# EAGLE design NRF24-zero-SHIM (EAGLE 9.6.2)
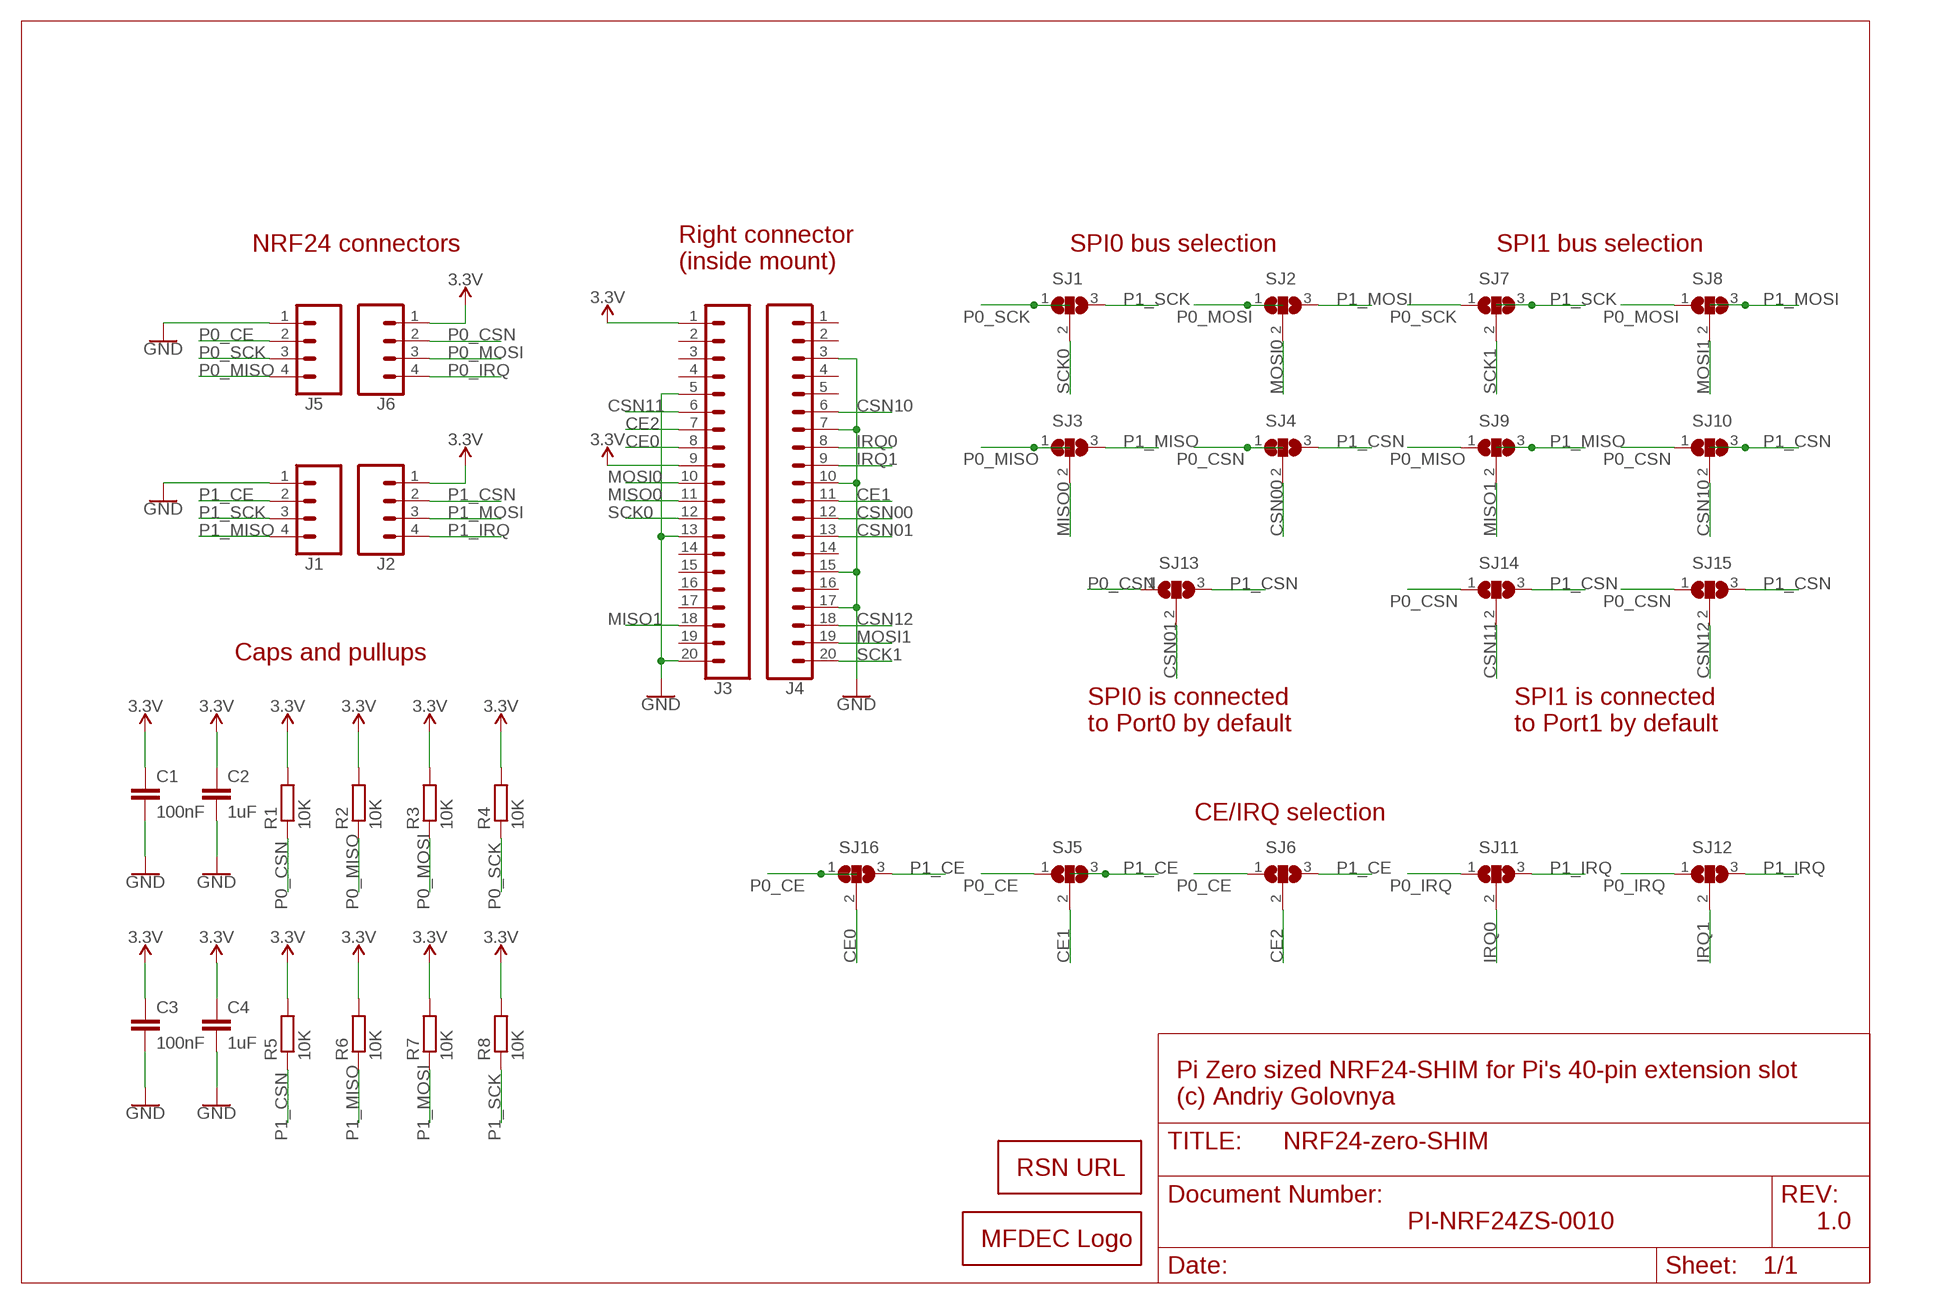
[diagram p0: schematic, sheet 1]

## Parts
C1  100nF  C-EUC0402  [C0402]
C2  1uF  C-EUC0603  [C0603]
C3  100nF  C-EUC0402  [C0402]
C4  1uF  C-EUC0603  [C0603]
J1  CONN_04LOCK  [1X04_LOCK]
J2  CONN_04LOCK  [1X04_LOCK]
J3  CONN_20LOCK  [1X20_LOCK]
J4  CONN_20LOCK  [1X20_LOCK]
J5  CONN_04LOCK  [1X04_LOCK]
J6  CONN_04LOCK  [1X04_LOCK]
LOGO1  MFDECLOGO_SQ_8MM  [MFDEC_SQ_8MM]
LOGO3  RSNURL_QR_10MM  [RSNURL_QR_10MM]
R1  10K  R-EU_R0402  [R0402]
R2  10K  R-EU_R0402  [R0402]
R3  10K  R-EU_R0402  [R0402]
R4  10K  R-EU_R0402  [R0402]
R5  10K  R-EU_R0402  [R0402]
R6  10K  R-EU_R0402  [R0402]
R7  10K  R-EU_R0402  [R0402]
R8  10K  R-EU_R0402  [R0402]
SJ1  SJ2  [SJ_2]
SJ2  SJ2  [SJ_2]
SJ3  SJ2  [SJ_2]
SJ4  SJ2  [SJ_2]
SJ5  SJ2  [SJ_2]
SJ6  SJ2  [SJ_2]
SJ7  SJ2  [SJ_2]
SJ8  SJ2  [SJ_2]
SJ9  SJ2  [SJ_2]
SJ10  SJ2  [SJ_2]
SJ11  SJ2  [SJ_2]
SJ12  SJ2  [SJ_2]
SJ13  SJ2  [SJ_2]
SJ14  SJ2  [SJ_2]
SJ15  SJ2  [SJ_2]
SJ16  SJ2  [SJ_2]

## Nets
3.3V: C1.1 C2.1 C3.1 C4.1 J2.1 J3.1 J3.9 J6.1 R1.2 R2.2 R3.2 R4.2 R5.2 R6.2 R7.2 R8.2
CE0: J3.8 SJ16.2
CE1: J4.11 SJ5.2
CE2: J3.7 SJ6.2
CSN00: J4.12 SJ4.2
CSN01: J4.13 SJ13.2
CSN10: J4.6 SJ10.2
CSN11: J3.6 SJ14.2
CSN12: J4.18 SJ15.2
GND: C1.2 C2.2 C3.2 C4.2 J1.1 J3.5 J3.13 J3.20 J4.3 J4.7 J4.10 J4.15 J4.17 J5.1
IRQ0: J4.8 SJ11.2
IRQ1: J4.9 SJ12.2
MISO0: J3.11 SJ3.2
MISO1: J3.18 SJ9.2
MOSI0: J3.10 SJ2.2
MOSI1: J4.19 SJ8.2
P0_CE: J5.2 SJ5.1 SJ6.1 SJ16.1
P0_CSN: J6.2 R1.1 SJ4.1 SJ10.1 SJ13.1 SJ14.1 SJ15.1
P0_IRQ: J6.4 SJ11.1 SJ12.1
P0_MISO: J5.4 R2.1 SJ3.1 SJ9.1
P0_MOSI: J6.3 R3.1 SJ2.1 SJ8.1
P0_SCK: J5.3 R4.1 SJ1.1 SJ7.1
P1_CE: J1.2 SJ5.3 SJ6.3 SJ16.3
P1_CSN: J2.2 R5.1 SJ4.3 SJ10.3 SJ13.3 SJ14.3 SJ15.3
P1_IRQ: J2.4 SJ11.3 SJ12.3
P1_MISO: J1.4 R6.1 SJ3.3 SJ9.3
P1_MOSI: J2.3 R7.1 SJ2.3 SJ8.3
P1_SCK: J1.3 R8.1 SJ1.3 SJ7.3
SCK0: J3.12 SJ1.2
SCK1: J4.20 SJ7.2
Unconnected: J3.2 J3.3 J3.4 J3.14 J3.15 J3.16 J3.17 J3.19 J4.1 J4.2 J4.4 J4.5 J4.14 J4.16

## Notes on the sheet
- NRF24 connectors | SPI0 bus selection | SPI1 bus selection
- Right connector
  (inside mount)
- Caps and pullups
- SPI0 is connected
  to Port0 by default
- SPI1 is connected
  to Port1 by default
- CE/IRQ selection
- Pi Zero sized NRF24-SHIM for Pi's 40-pin extension slot
  (c) Andriy Golovnya
- PI-NRF24ZS-0010 | 1.0

## Library data of the parts
C1-C4 = rcl:C-EU: CAPACITOR, European symbol; SPICEPREFIX: C
J1 J2 J5 J6 = _my_locked_connectors:CONN_04: Multi connection point. Often used as Generic Header-pin footprint for 0.1 inch spaced/style header connections On any of the 0.1 inch spaced packages, you can populate with these: Break Away Headers - Straight <https://www.sparkfun.com/products/116> (PRT-00116) Break Away Male Headers - Right Angle <https://www.sparkfun.com/products/553> (PRT-00553) Female Headers <https://www.sparkfun.com/products/115> (PRT-00115) Break Away Headers - Machine Pin <https://www.sparkfun.com/products/117> (PRT-00117) Break Away Female Headers - Swiss Machine Pin <https://www.sparkfun.com/products/743> (PRT-00743) For SCREWTERMINALS and SPRING TERMINALS visit here: Screw Terimnals on SparkFun.com <https://www.sparkfun.com/search/results?term=Screw+Terminals> (5mm/3.5mm/2.54mm spacing) This device is also useful as a general connection point to wire up your design to another part of your project. Our various solder wires solder well into these plated through hole pads. Hook-Up Wire - Assortment (Stranded, 22 AWG) <https://www.sparkfun.com/products/11375> (PRT-11375) Hook-Up Wire - Assortment (Solid Core, 22 AWG) <https://www.sparkfun.com/products/11367> (PRT-11367) View the entire wire category on our website here <https://www.sparkfun.com/categories/141> Special notes: Molex polarized connector foot print use with SKU : PRT-08231 with associated crimp pins and housings. 1MM SMD Version SKU: PRT-10208; PROD_ID: CONN-09696
J3 J4 = _my_locked_connectors:CONN_20: Multi connection point. Often used as Generic Header-pin footprint for 0.1 inch spaced/style header connections On any of the 0.1 inch spaced packages, you can populate with these: Break Away Headers - Straight <https://www.sparkfun.com/products/116> (PRT-00116) Break Away Male Headers - Right Angle <https://www.sparkfun.com/products/553> (PRT-00553) Female Headers <https://www.sparkfun.com/products/115> (PRT-00115) Break Away Headers - Machine Pin <https://www.sparkfun.com/products/117> (PRT-00117) Break Away Female Headers - Swiss Machine Pin <https://www.sparkfun.com/products/743> (PRT-00743) For SCREWTERMINALS and SPRING TERMINALS visit here: Screw Terimnals on SparkFun.com <https://www.sparkfun.com/search/results?term=Screw+Terminals> (5mm/3.5mm/2.54mm spacing) This device is also useful as a general connection point to wire up your design to another part of your project. Our various solder wires solder well into these plated through hole pads. Hook-Up Wire - Assortment (Stranded, 22 AWG) <https://www.sparkfun.com/products/11375> (PRT-11375) Hook-Up Wire - Assortment (Solid Core, 22 AWG) <https://www.sparkfun.com/products/11367> (PRT-11367) View the entire wire category on our website here <https://www.sparkfun.com/categories/141> Special notes: Molex polarized connector foot print use with SKU : PRT-08231 with associated crimp pins and housings. 1MM SMD Version SKU: PRT-10208 NOTES ON THE VARIANTS LOCK and LOCK_LONGPADS... This footprint was designed to help hold the alignment of a through-hole component (i.e. 6-pin header) while soldering it into place. You may notice that each hole has been shifted either up or down by 0.005 of an inch from it's more standard position (which is a perfectly straight line). This slight alteration caused the pins (the squares in the middle) to touch the edges of the holes. Because they are alternating, it causes a "brace" to hold the component in place. 0.005 has proven to be the perfect amount of "off-center" position when using our standard breakaway headers. Although looks a little odd when you look at the bare footprint, once you have a header in there, the alteration is very hard to notice. Also,if you push a header all the way into place, it is covered up entirely on the bottom side. Note about LOCK SPECIAL package: This is just like the LOCK variant in that the holes are staggared by 5 mil, but except for the last two holes. They are not altered from the "standard" footprint layout. This is used for a special purpose on the layout of our Graphic LCD Backpack. Make sure you want to use this device before selecting it for you project!
LOGO1 = _my_logos:MFDECLOGO: Midnight Fog - Digital Eye Candy LOGO
LOGO3 = _my_logos:RSNURL: RedScorp.Net URL
R1-R8 = rcl:R-EU_: RESISTOR, European symbol; SPICEPREFIX: R
SJ1-SJ16 = _my_jumpers:SJ2: SMD solder JUMPER SJ2 - simple jumper SJ2FI - fancy inside jumper SJ2FO - fancy outside jumper SJ2FL - fancy left jumper SJ2FR - fancy right jumper SJ2W - wide jumper

## Board
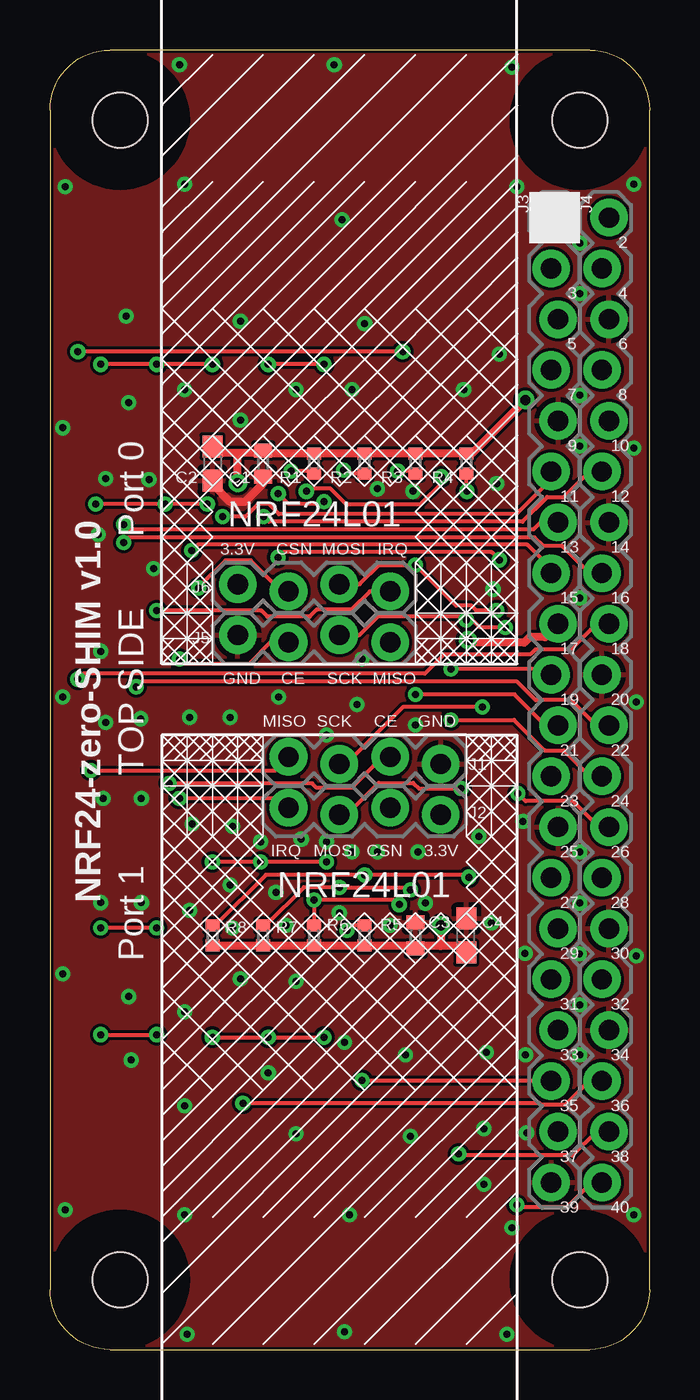
[diagram p1: board, top side]
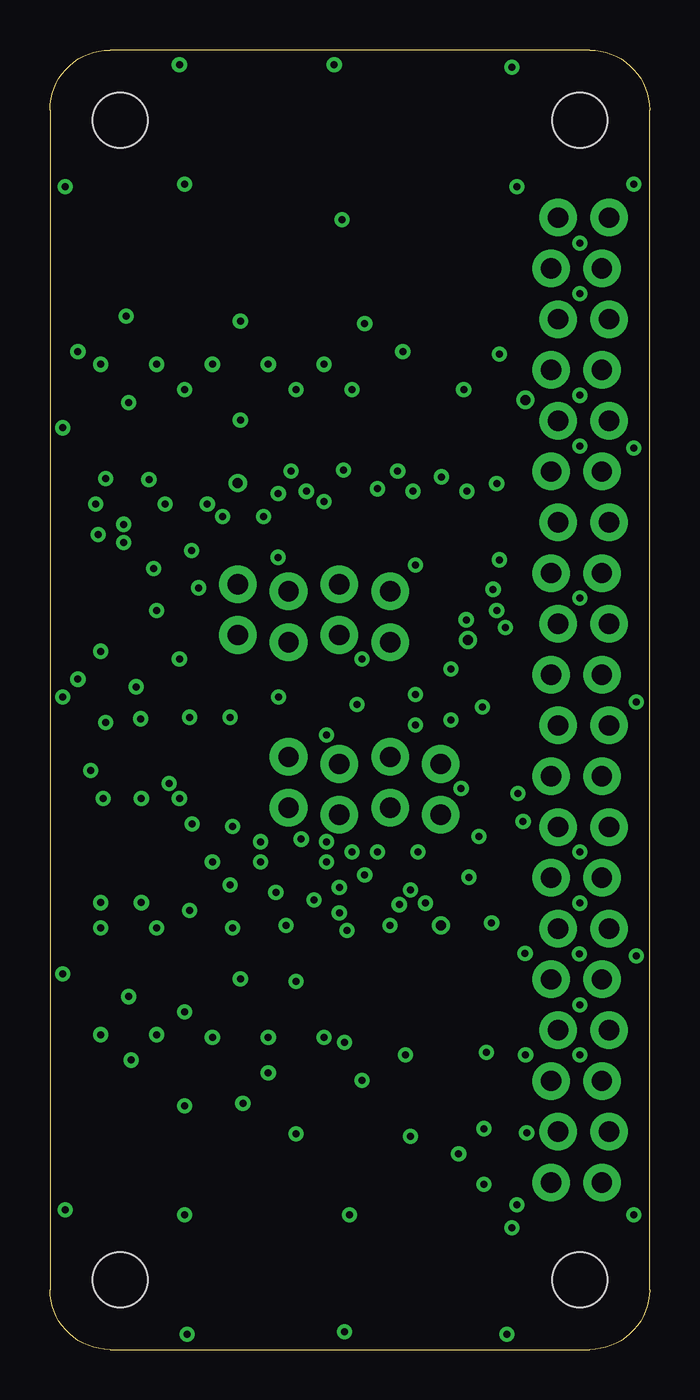
[diagram p2: board, inner layer Route2]
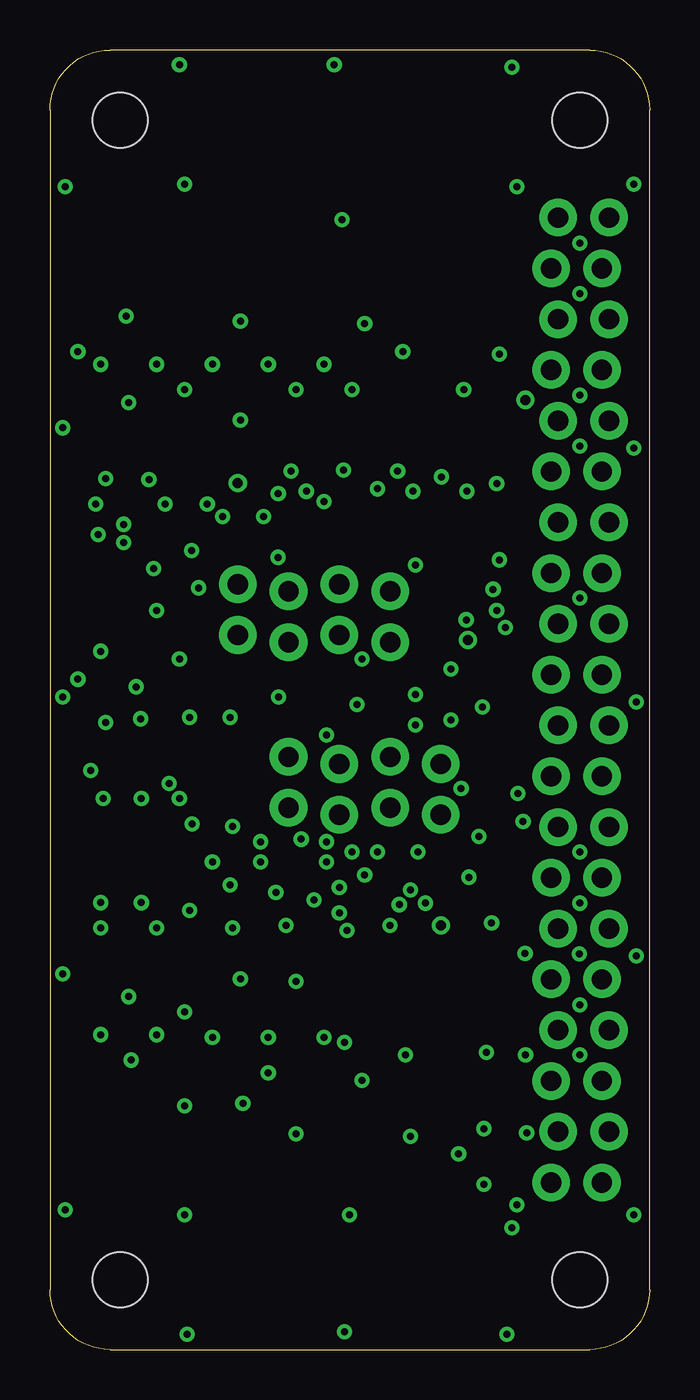
[diagram p3: board, inner layer Route15]
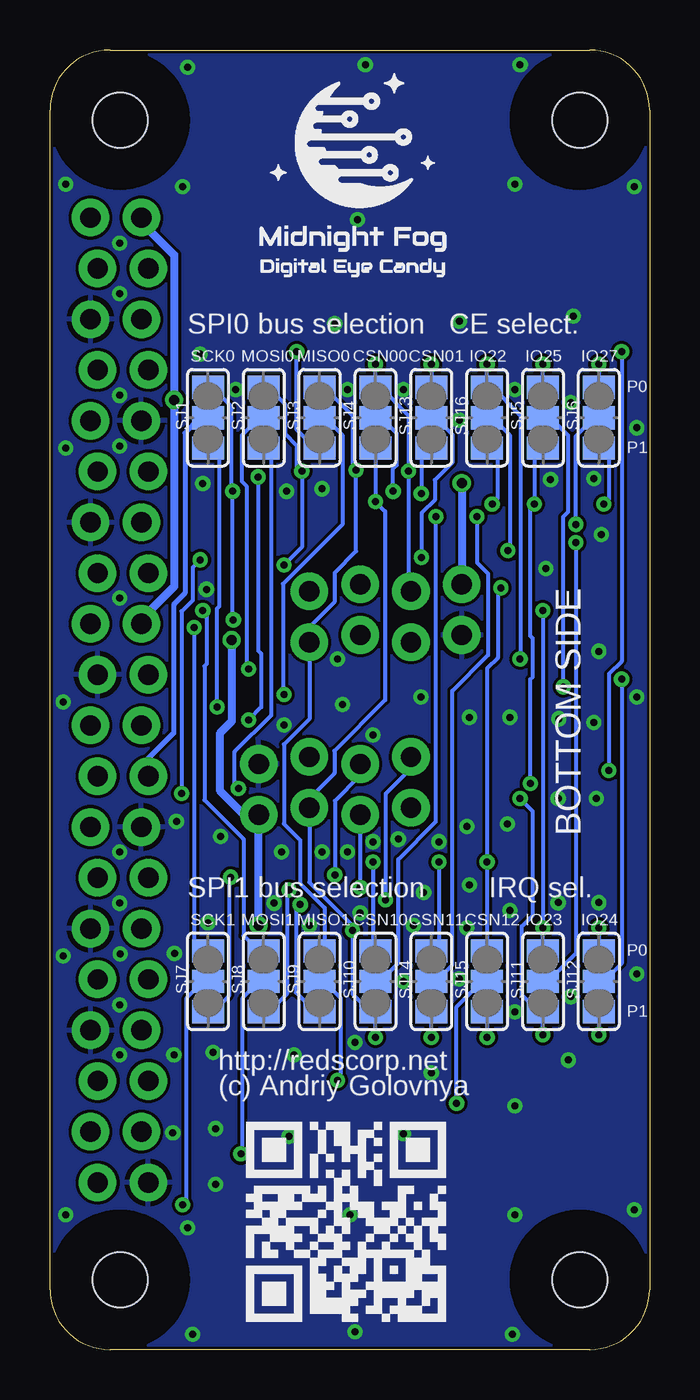
[diagram p4: board, bottom side, seen from below]

Size 30 x 65 mm. Coordinates in mm from the lower left corner, seen from the top.
Outline: 3,0 27,0 arc90 30,3 30,62 arc90 27,65 3,65 arc90 0,62 0,3 arc90 3,0
Copper layers (1*16): Top 0.035mm / dielectric 1.5mm / Bottom 0.035mm
Design rules "default *": minimum track width 6mil, minimum drill 0.35mm, track to track 6mil, track to pad 6mil, pad to pad 6mil, via to via 6mil, smd to smd 6mil, copper to edge 6mil, drill to drill 6mil, minimum pad ring 10mil, minimum via ring 8mil, stop-mask expansion 4mil, vias tented up to drill 20mil, thermal gap 10mil
Holes 2.75 mm at 3.5,3.5 26.5,3.5 3.5,61.5 26.5,61.5

### Footprints (pad centres in the part's own frame; a part is rotated, then mirrored left to right if it is on the bottom)
C0402 = smd 0.7 x 0.9: 1 -0.65,0; 2 0.65,0
C0603 = smd 1.1 x 1: 1 -0.85,0; 2 0.85,0
1X04_LOCK = drill 1.016 pad 1.88: 1 0,0.178; 2 2.54,-0.178; 3 5.08,0.178; 4 7.62,-0.178
1X20_LOCK = drill 1.016 pad 1.88: 1 0,0.178; 2 2.54,-0.178; 3 5.08,0.178; 4 7.62,-0.178; 5 10.16,0.178; 6 12.7,-0.178; 7 15.24,0.178; 8 17.78,-0.178; 9 20.32,0.178; 10 22.86,-0.178; 11 25.4,0.178; 12 27.94,-0.178; 13 30.48,0.178; 14 33.02,-0.178; 15 35.56,0.178; 16 38.1,-0.178; 17 40.64,0.178; 18 43.18,-0.178; 19 45.72,0.178; 20 48.26,-0.178
R0402 = smd 0.6 x 0.7: 1 -0.5,0; 2 0.5,0
SJ_2 = smd 1.168 x 1.6: 1 -1.524,0; 2 0,0; 3 1.524,0

### Placement (x,y rotation side)
C1  10.67,44.32 270 top
C2  8.13,44.32 270 top
C3  18.29,20.7 90 top
C4  20.83,20.7 90 top
J1  19.56,29.46 180 top
J2  19.56,26.92 180 top
J3  25.25,56.62 270 top
J4  27.79,56.62 270 top
J5  9.4,35.56 0 top
J6  9.4,38.1 0 top
LOGO1  20.19,53.34 0 bottom
LOGO3  20.19,1.4 0 bottom
R1  13.21,44.32 90 top
R2  15.75,44.32 90 top
R3  18.29,44.32 90 top
R4  20.83,44.32 90 top
R5  15.75,20.7 270 top
R6  13.21,20.7 270 top
R7  10.67,20.7 270 top
R8  8.13,20.7 270 top
SJ1  22.1,46.61 270 bottom
SJ2  19.3,46.61 270 bottom
SJ3  16.51,46.61 270 bottom
SJ4  13.72,46.61 270 bottom
SJ5  5.33,46.61 270 bottom
SJ6  2.54,46.61 270 bottom
SJ7  22.1,18.41 270 bottom
SJ8  19.3,18.41 270 bottom
SJ9  16.51,18.41 270 bottom
SJ10  13.72,18.41 270 bottom
SJ11  5.33,18.41 270 bottom
SJ12  2.54,18.41 270 bottom
SJ13  10.92,46.61 270 bottom
SJ14  10.92,18.41 270 bottom
SJ15  8.13,18.41 270 bottom
SJ16  8.13,46.61 270 bottom

### Tracks (layer width: path | path; a pad name or v marks a point on that pad's centre or on a via)
3.3V  (via drill 0.5)
  Top 0.406: R8.2 R7.2 R6.2 R5.2 18.14,20.2 C3.1 18.41,20.18 19.56,20.18 | 19.56,20.18 20.5,20.18 C4.1 | 9.4,44.85 10.54,44.85 C1.1 10.82,44.82 R1.2 R2.2 R3.2 R4.2 21.11,44.82 v23.78,47.5 | 9.4,44.85 8.46,44.85 C2.1 | v19.56,21.21 19.56,20.18 | v9.4,43.33 9.4,44.85 | J3.9 24.77,35.63 24.01,35.63 23.73,35.35 21.03,35.35 v20.9,35.48
  Bottom 0.406: J3.1 25.4,56.59 25.4,56.36 23.78,54.74 v23.78,47.5 23.78,38.17 25.43,36.52 J3.9 | v19.56,21.21 J2.1 20.29,26.75 21.51,27.97 21.51,30.81 20.9,31.42 v20.9,35.48 | v9.4,43.33 J6.1
CE0  (via drill 0.35)
  Top 0.203: J3.8 25.08,39.06 23.88,40.26 7.4,40.26 v7.1,39.95
  Bottom 0.152: SJ16.2 8.13,47.57
  Bottom 0.203: v7.1,39.95 7,40.06 7,45.73 7.87,46.61 SJ16.2
CE1  (via drill 0.35)
  Top 0.203: J4.11 27.34,31.21 26.07,32.48 24.29,32.48 23.37,33.4 4.57,33.4 v4.32,33.15
  Bottom 0.152: SJ5.2 5.33,45.64
  Bottom 0.203: v4.32,33.15 4.32,41.66 4.06,41.91 4.06,45.72 4.95,46.61 SJ5.2
CE2  (via drill 0.35)
  Top 0.203: J3.7 24.54,41.38 24.19,41.02 3.94,41.02 v3.68,41.27
  Bottom 0.203: SJ6.2 2.76,46.61 3.68,45.69 v3.68,41.27
CSN00  (via drill 0.35)
  Top 0.203: v12.83,42.93 12.95,43.05 14.04,43.05 14.8,42.29 18.55,42.29 19.58,43.33 v19.58,43.65 | J4.12 27.02,28.68 25.72,29.97 24.74,29.97 23.22,31.5 v20.07,31.5
  Bottom 0.152: SJ4.2 13.72,47.57
  Bottom 0.203: SJ4.2 13.44,46.61 12.66,45.83 12.66,44.23 12.83,44.07 v12.83,42.93 | v19.58,43.65 19.58,34.95 19.43,34.81 19.43,32.13 v20.07,31.5
CSN01  (via drill 0.35)
  Top 0.203: v11.4,39.62 11.66,39.88 22.1,39.88 v22.48,39.5 | v23.42,27.81 23.8,27.43 26.17,27.43 27.46,26.14 J4.13
  Bottom 0.203: SJ13.2 10.7,46.61 9.87,45.77 9.87,44.37 10.74,43.49 10.74,42.5 11.4,41.84 v11.4,39.63 v11.4,39.62 | v22.48,39.5 22.86,39.12 22.86,37.47 23.42,36.91 v23.42,27.81
CSN10  (via drill 0.35)
  Top 0.203: v10.69,41.66 10.95,41.4 23.64,41.4 24.89,42.65 25.71,42.65 26.98,43.91 J4.6
  Bottom 0.152: SJ10.2 13.72,17.45
  Bottom 0.203: SJ10.2 13.5,18.41 12.57,19.34 12.57,24.52 10.69,26.4 v10.69,41.66
CSN11  (via drill 0.35)
  Top 0.203: J3.6 25.08,43.53 23.32,41.78 11.46,41.78 10.96,42.29 10.41,42.29 9.78,41.66 v8.64,41.66
  Bottom 0.203: SJ14.2 10.7,18.41 9.87,19.25 9.87,32.95 8.08,34.73 8.08,38.81 8.64,39.37 v8.64,41.66
CSN12  (via drill 0.35)
  Top 0.203: v9.65,12.32 24.5,12.32 24.58,12.24 25.79,12.24 26.98,13.44 J4.18
  Bottom 0.203: v9.65,12.32 9.65,17.14 8.38,18.41 SJ15.2
GND  (via drill 0.35)
  Top 0.406: C2.2 8.13,43.28 9.01,42.4 9.75,42.4 10.67,43.32 C1.2
  other vias: 17.78,14.73 18.8,22.33 22.1,21.34 21.46,25.65 18.41,24.89 16.38,24.89 15.11,24.89 13.84,25.4 12.57,25.53 10.54,25.4 11.81,21.21 11.3,22.86 9.53,18.54 12.32,18.41 14.73,15.37 10.92,13.84 9.02,23.24 9.14,21.08 9.14,26.16 9.02,31.62 13.84,30.73 11.43,32.64 15.37,32.26 18.29,31.24 4.95,43.51 5.18,39.07 4.55,31.55 6.99,31.62 4.57,27.56 4.57,22.35 2.67,27.56 2.54,22.35 2.79,31.37 2.54,34.92 2.79,43.56 2.41,40.77 3.94,17.65 6.73,16.89 6.73,12.19 4.06,14.48 21.84,14.86 21.72,11.05 21.72,8.26 18.03,10.67 22.86,0.76 29.21,6.73 6.86,0.76 0.76,6.99 0.64,18.8 0.64,32.64 0.64,46.1 0.76,58.17 6.48,64.26 23.11,64.14 29.21,58.29 22.48,49.78 15.11,48.01 12.32,48.01 9.53,46.48 3.94,47.37 6.73,48.01 23.37,58.17 6.73,58.29 6.73,6.73 23.11,6.1 29.34,32.38 29.21,45.09 29.34,19.68 14.73,0.89 14.99,6.73 12.32,10.79 14.22,64.26 14.61,56.52 20.7,48.01 15.75,51.31 9.53,51.44 3.81,51.69 22.35,43.31 22.17,38.02 15.62,34.54 6.99,21.97 7.11,26.29 26.52,14.73 26.52,17.25 26.49,19.79 26.52,22.33 26.52,24.89 23.67,26.42 26.52,37.59 26.52,45.19 26.52,47.73 26.52,52.81 26.52,55.35 23.77,19.81 23.8,14.73 23.85,10.85 17.02,21.21 18.16,42.93 16.38,43.05 14.48,21.84
  pour Top: 0,0 0,65.02 35.05,65.02 35.05,0
  pour Bottom: 0,0 0,65.02 40.01,65.02 40.01,0
GND1
  cutout Top: 26.5,0 arc-180 26.5,7 arc-180
  cutout Route2: 26.5,0 arc-180 26.5,7 arc-180
  cutout Route15: 26.5,0 arc-180 26.5,7 arc-180
  cutout Bottom: 26.5,0 arc-180 26.5,7 arc-180
GND2
  cutout Top: 3.5,58 arc-180 3.5,65 arc-180
  cutout Route2: 3.5,58 arc-180 3.5,65 arc-180
  cutout Route15: 3.5,58 arc-180 3.5,65 arc-180
  cutout Bottom: 3.5,58 arc-180 3.5,65 arc-180
GND3
  cutout Top: 26.5,58 arc-180 26.5,65 arc-180
  cutout Route2: 26.5,58 arc-180 26.5,65 arc-180
  cutout Route15: 26.5,58 arc-180 26.5,65 arc-180
  cutout Bottom: 26.5,58 arc-180 26.5,65 arc-180
GND4
  cutout Top: 3.5,0 arc-180 3.5,7 arc-180
  cutout Route2: 3.5,0 arc-180 3.5,7 arc-180
  cutout Route15: 3.5,0 arc-180 3.5,7 arc-180
  cutout Bottom: 3.5,0 arc-180 3.5,7 arc-180
IRQ0  (via drill 0.35)
  Top 0.203: v3.68,40.37 3.94,40.62 24.24,40.62 24.68,40.18 25.64,40.18 26.98,38.84 J4.8
  Bottom 0.203: v3.68,40.37 3.68,19.81 5.08,18.41 SJ11.2
IRQ1  (via drill 0.35)
  Top 0.203: J4.9 27.34,36.3 26.07,35.02 24.29,35.02 24.04,34.77 19.72,34.77 18.75,33.81 1.68,33.81 v1.4,33.53
  Bottom 0.203: v1.4,33.53 1.4,19.3 2.29,18.41 SJ12.2
MISO0  (via drill 0.35)
  Top 0.203: J3.11 24.8,31.21 23.25,32.76 v18.29,32.76
  Bottom 0.152: SJ3.2 16.51,47.57
  Bottom 0.203: SJ3.2 16.23,46.61 15.37,45.75 15.37,41.26 18.34,38.29 18.34,32.81 v18.29,32.76
MISO1  (via drill 0.35)
  Top 0.203: J3.18 15.65,13.44 v15.62,13.46
  Bottom 0.152: SJ9.2 16.51,17.45
  Bottom 0.203: SJ9.2 16.29,18.41 15.46,17.58 15.46,13.63 v15.62,13.46
MOSI0  (via drill 0.35)
  Top 0.203: v20.07,34.04 24.8,34.04 J3.10
  Bottom 0.152: SJ2.2 19.3,47.57
  Bottom 0.203: SJ2.2 19.52,46.61 20.41,45.72 20.41,43.43 20.17,43.19 20.17,34.14 v20.07,34.04
MOSI1  (via drill 0.35)
  Top 0.203: v20.45,9.78 20.52,9.7 26.14,9.7 27.34,10.89 J4.19
  Bottom 0.152: SJ8.2 19.3,17.45
  Bottom 0.203: v20.45,9.78 20.36,9.87 20.36,17.58 19.52,18.41 SJ8.2
P0_CE  (via drill 0.35)
  Top 0.203: J5.2 11.05,35.38 9.96,34.29 6.73,34.29 v6.48,34.54 | v8.13,49.28 v5.33,49.28 v2.54,49.28
  Bottom 0.203: v6.48,34.54 6.46,34.56 6.46,46.72 7.87,48.13 SJ16.1 v8.13,49.28 | v2.54,49.28 SJ6.1 | SJ5.1 v5.33,49.28
P0_CSN  (via drill 0.35)
  Top 0.203: R1.1 13.09,43.94 v12.06,43.94 | v13.84,24.38 v10.54,24.38 v8.13,24.38 | v13.72,49.28 v10.92,49.28 | J6.2 11.59,37.92 10.04,39.47 8.78,39.47 7.44,38.14 v7.44,38.1
  Bottom 0.203: J6.2 12.06,38.05 v12.06,43.94 v12.05,43.94 12.05,46.72 13.46,48.13 SJ4.1 v13.72,49.28 | SJ10.1 13.84,20.06 v13.84,24.38 | v10.54,24.38 10.54,20.32 SJ14.1 | SJ15.1 v8.13,24.38 8.13,34.05 7.59,34.59 7.59,37.95 v7.44,38.1 | v10.92,49.28 SJ13.1
P0_IRQ  (via drill 0.35)
  Top 0.203: v5.33,21.08 v2.54,21.08 | J6.4 16,37.92 15.09,37.01 13.35,37.01 12.99,36.65 10.88,36.65 10.58,36.96 v5.33,36.96
  Bottom 0.203: SJ11.1 v5.33,21.08 v5.33,36.96 | v2.54,21.08 SJ12.1
P0_MISO  (via drill 0.35)
  Top 0.203: R2.1 14.85,43.82 v14.68,43.99
  Bottom 0.203: SJ3.1 16.29,48.13 14.87,46.71 14.87,44.18 v14.68,43.99 14.68,39.93 15.75,38.86 15.75,37.41 17.02,36.14 J5.4 17.02,31.53 18.29,30.26 18.29,26.29 17.48,25.48 17.48,23.32 16.26,22.1 16.26,20.19 SJ9.1
P0_MOSI  (via drill 0.35)
  Top 0.203: R3.1 18.17,43.94 v17.4,43.94 | J6.3 15.49,38.28 16.46,39.24 v18.29,39.24 20.32,37.21 21.08,37.21 21.34,36.96 v22.35,36.96
  Bottom 0.203: SJ2.1 19.08,48.13 18.25,47.3 18.25,45.81 17.65,45.21 17.65,44.2 v17.4,43.94 17.4,40.13 v18.29,39.24 | SJ8.1 19.56,19.94 20.32,20.7 20.32,25.54 22.27,27.48 22.27,34.19 22.15,34.3 22.15,36.76 v22.35,36.96
P0_SCK  (via drill 0.35)
  Top 0.203: v20.85,42.93 20.83,42.95 R4.1 | J5.3 15.49,35.74 16.41,36.65 20.67,36.65 v20.82,36.5 21.13,36.5 21.51,36.11 v22.78,36.11
  Bottom 0.203: SJ1.1 21.88,48.13 20.94,47.2 20.94,43.02 v20.85,42.93 20.85,36.52 v20.82,36.5 | v22.78,36.11 22.78,20.27 22.45,19.94 SJ7.1
P1_CE  (via drill 0.35)
  Top 0.203: v7.87,42.29 v5.77,42.29 v2.29,42.29 | J1.2 16.65,29.64 15.1,28.09 13.35,28.09 13.12,28.32 v5.97,28.32
  Bottom 0.203: SJ16.3 7.62,44.58 7.62,42.55 v7.87,42.29 | SJ5.3 5.77,44.65 v5.77,42.29 5.97,42.09 5.97,35.69 5.84,35.57 5.84,33.65 5.97,33.53 v5.97,28.32 | SJ6.3 2.29,45.09 2.03,44.83 2.03,42.55 v2.29,42.29
P1_CSN  (via drill 0.35)
  Top 0.203: v8.13,15.62 v10.92,15.62 v13.72,15.62 | R5.1 15.11,21.2 v14.86,20.95 | v13.72,42.41 13.59,42.29 11.95,42.29 v11.42,42.82
  Bottom 0.203: SJ15.3 v8.13,15.62 | v10.92,15.62 SJ14.3 | v13.72,15.62 SJ10.3 13.97,16.89 14.86,17.78 v14.86,20.95 14.86,21.21 17.02,23.37 J2.2 17.02,27.57 15.77,28.82 15.77,29.95 13.23,32.49 13.23,41.92 13.72,42.4 v13.72,42.41 SJ4.3 | SJ13.3 11.3,45.09 11.42,44.97 v11.42,42.82
P1_IRQ  (via drill 0.35)
  Top 0.203: v2.54,15.75 v5.33,15.75 | J2.4 11.48,27.56 v6.48,27.56
  Bottom 0.203: SJ12.3 v2.54,15.75 | v5.33,15.75 SJ11.3 5.55,16.89 6.39,17.73 6.39,21.17 5.84,21.72 5.84,26.92 v6.48,27.56
P1_MISO  (via drill 0.35)
  Top 0.203: v17.48,22.25 17.24,22.48 v13.21,22.48 R6.1 | v17.65,49.91 v1.4,49.91 | v2.03,28.96 11.25,28.96 J1.4
  Bottom 0.203: v17.48,22.25 v17.48,22.24 17.69,22.02 17.69,17.85 16.73,16.89 SJ9.3 | J1.4 11.94,29.06 13.21,27.79 v13.21,22.48 | SJ3.3 16.73,45.09 17.65,46.01 v17.65,49.91 | v1.4,49.91 1.4,34.42 2.03,33.79 v2.03,28.96
P1_MOSI  (via drill 0.35)
  Top 0.203: J2.3 14.85,26.75 16.45,28.35 18.18,28.35 18.48,28.04 20.55,28.04 v20.57,28.07 | v18.03,22.99 17.91,23.11 v14.48,23.11 12.7,23.11 10.79,21.2 R7.1
  Bottom 0.203: SJ2.3 18.92,44.7 18.92,31.74 20.75,29.91 20.75,28.23 20.59,28.07 v20.57,28.07 | v18.03,22.99 18.16,22.86 18.16,22.82 18.15,22.83 18.15,17.79 19.05,16.89 SJ8.3 | J2.3 v14.48,23.11
P1_SCK  (via drill 0.35)
  Top 0.203: v21.64,32.13 17.65,32.13 14.81,29.29 J1.3 | v20.95,23.62 20.83,23.75 v15.75,23.75 10.8,23.75 8.26,21.2 R8.1
  Bottom 0.203: SJ1.3 21.84,45.09 21.52,44.76 21.52,37.18 21.64,37.06 v21.64,32.13 | v20.95,23.62 21.04,23.53 21.04,17.69 21.84,16.89 SJ7.3 | J1.3 14.48,28.71 15.75,27.44 v15.75,23.75
SCK0
  Bottom 0.152: SJ1.2 22.1,47.57
  Bottom 0.254: J3.12 25.08,29.56 23.81,30.83 23.81,37.26 23.24,37.83 23.24,45.85 22.48,46.61 SJ1.2
SCK1  (via drill 0.35)
  Top 0.203: J4.20 27.11,8.36 25.86,7.11 23.5,7.11 v23.37,7.24
  Bottom 0.152: SJ7.2 22.1,17.45
  Bottom 0.203: SJ7.2 22.32,18.41 23.15,17.58 23.15,7.46 v23.37,7.24

### Text on the board
tPlace: 2 | 3 | 4 | 5 | 6 | 7 | 8 | 9 | 10 | 11 | 12 | Port 0 | NRF24L01 | 3.3V | CSN | MOSI | IRQ | 13 | 14 | 15 | 16 | 17 | 18 | GND | CE | SCK | MISO | MISO | SCK | CE | GND | 19 | 20 | 21 | 22 | TOP SIDE | 23 | 24 | IRQ | MOSI | CSN | 3.3V | 25 | 26 | NRF24L01 | NRF24-zero-SHIM v1.0 | 27 | 28 | 29 | 30 | Port 1 | 31 | 32 | 33 | 34 | 35 | 36 | 37 | 38 | 39 | 40
bPlace: SPI0 bus selection CE select. | IO27 | IO25 | IO22 | CSN01 | CSN00 | MISO0 | MOSI0 | SCK0 | P0 | P1 | BOTTOM SIDE | SPI1 bus selection IRQ sel. | IO24 | IO23 | CSN12 | CSN11 | CSN10 | MISO1 | MOSI1 | SCK1 | P0 | P1 | http://redscorp.net | (c) Andriy Golovnya